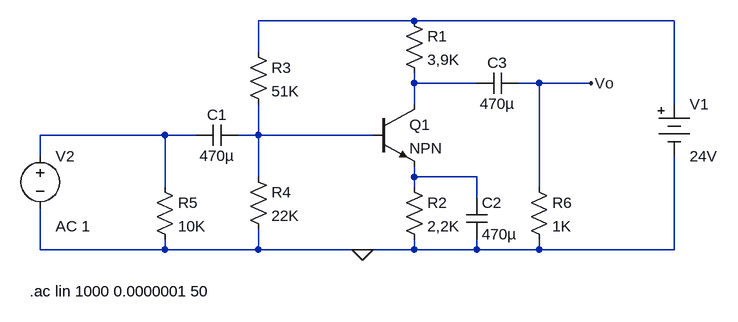
[diagram p0: schematic Cicuito EMISOR COMUN.asc]
Cicuito EMISOR COMUN.asc, the LTspice schematic file:
Version 4
SHEET 1 880 680
WIRE 240 0 0 0
WIRE 640 0 240 0
WIRE 0 48 0 0
WIRE 240 96 240 80
WIRE 336 96 240 96
WIRE 432 96 400 96
WIRE 512 96 432 96
WIRE 240 128 240 96
WIRE 640 128 640 0
WIRE -144 176 -336 176
WIRE -96 176 -144 176
WIRE 0 176 0 128
WIRE 0 176 -32 176
WIRE 176 176 0 176
WIRE -336 208 -336 176
WIRE 0 240 0 176
WIRE 240 240 240 224
WIRE 336 240 240 240
WIRE -144 256 -144 176
WIRE 240 256 240 240
WIRE 432 256 432 96
WIRE 336 272 336 240
WIRE -336 352 -336 288
WIRE -144 352 -144 336
WIRE -144 352 -336 352
WIRE 0 352 0 320
WIRE 0 352 -144 352
WIRE 160 352 0 352
WIRE 240 352 240 336
WIRE 240 352 160 352
WIRE 336 352 336 336
WIRE 336 352 240 352
WIRE 432 352 432 336
WIRE 432 352 336 352
WIRE 640 352 640 208
WIRE 640 352 432 352
FLAG 512 96 Vo
FLAG 160 352 0
SYMBOL npn 176 128 R0
SYMATTR InstName Q1
SYMBOL res 224 -16 R0
SYMATTR InstName R1
SYMATTR Value 3,9K
SYMBOL res 224 240 R0
SYMATTR InstName R2
SYMATTR Value 2,2K
SYMBOL res -16 32 R0
SYMATTR InstName R3
SYMATTR Value 51K
SYMBOL res -16 224 R0
SYMATTR InstName R4
SYMATTR Value 22K
SYMBOL res -160 240 R0
SYMATTR InstName R5
SYMATTR Value 10K
SYMBOL cap -32 160 R90
WINDOW 0 0 32 VBottom 2
WINDOW 3 32 32 VTop 2
SYMATTR InstName C1
SYMATTR Value 470µ
SYMBOL cap 320 272 R0
SYMATTR InstName C2
SYMATTR Value 470µ
SYMBOL cap 400 80 R90
WINDOW 0 0 32 VBottom 2
WINDOW 3 32 32 VTop 2
SYMATTR InstName C3
SYMATTR Value 470µ
SYMBOL res 416 240 R0
SYMATTR InstName R6
SYMATTR Value 1K
SYMBOL Misc\\battery 640 112 R0
WINDOW 123 0 0 Left 0
WINDOW 39 0 0 Left 0
SYMATTR InstName V1
SYMATTR Value 24V
SYMBOL voltage -336 192 R0
WINDOW 123 24 124 Left 2
WINDOW 39 0 0 Left 0
SYMATTR InstName V2
SYMATTR Value ""
SYMATTR Value2 AC 1
TEXT -352 416 Left 2 !.ac lin 1000 0.0000001 50

The netlist it stands for:
* Cicuito EMISOR COMUN.asc
Q1 N002 N004 N005 0 NPN
R1 N001 N002 3,9K
R2 N005 0 2,2K
R3 N001 N004 51K
R4 N004 0 22K
R5 N003 0 10K
C1 N004 N003 470µ
C2 N005 0 470µ
C3 Vo N002 470µ
R6 Vo 0 1K
V1 N001 0 24V
V2 N003 0 AC 1
.model NPN NPN
.model PNP PNP
.lib standard.bjt
.ac lin 1000 0.0000001 50
.backanno
.end